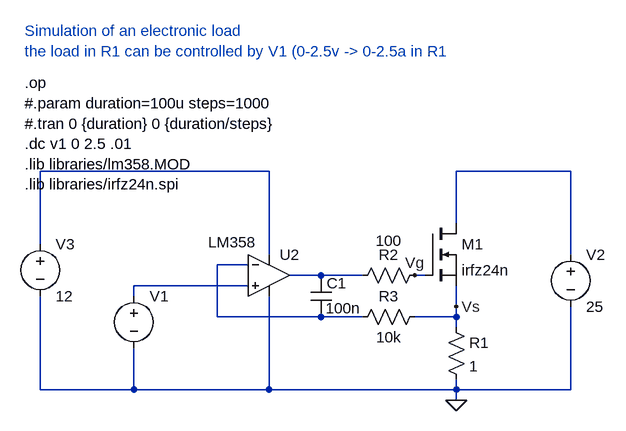
[diagram p0: schematic dummyload.asc]
dummyload.asc, the LTspice schematic file:
Version 4
SHEET 1 968 680
WIRE 336 144 -16 144
WIRE 800 144 624 144
WIRE 624 224 624 144
WIRE -16 256 -16 144
WIRE 336 272 336 144
WIRE 800 272 800 144
WIRE 304 288 256 288
WIRE 416 304 368 304
WIRE 480 304 416 304
WIRE 576 304 560 304
WIRE 304 320 128 320
WIRE 128 336 128 320
WIRE 624 352 624 320
WIRE 256 368 256 288
WIRE 416 368 256 368
WIRE 480 368 416 368
WIRE 624 368 624 352
WIRE 624 368 560 368
WIRE 624 384 624 368
WIRE -16 480 -16 336
WIRE 128 480 128 416
WIRE 128 480 -16 480
WIRE 336 480 336 336
WIRE 336 480 128 480
WIRE 624 480 624 464
WIRE 624 480 336 480
WIRE 800 480 800 352
WIRE 800 480 624 480
WIRE 624 496 624 480
FLAG 624 496 0
FLAG 560 304 Vg
FLAG 624 352 Vs
SYMBOL Voltage 800 256 R0
SYMATTR InstName V2
SYMATTR Value 25
SYMBOL Res 608 368 R0
SYMATTR InstName R1
SYMATTR Value 1
SYMBOL Res 576 288 R90
WINDOW 0 0 56 VBottom 2
WINDOW 3 -53 56 VTop 2
SYMATTR InstName R2
SYMATTR Value 100
SYMBOL nmos 576 224 R0
SYMATTR InstName M1
SYMATTR Value irfz24n
SYMATTR Prefix X
SYMBOL Voltage 128 320 R0
SYMATTR InstName V1
SYMATTR Value ""
SYMBOL OpAmps/opamp2 336 240 R0
WINDOW 3 -94 13 Left 2
SYMATTR Value LM358
SYMATTR InstName U2
SYMBOL Voltage -16 240 R0
SYMATTR InstName V3
SYMATTR Value 12
SYMBOL Res 576 352 R90
WINDOW 0 0 56 VBottom 2
WINDOW 3 32 56 VTop 2
SYMATTR InstName R3
SYMATTR Value 10k
SYMBOL Cap 400 304 R0
WINDOW 0 25 12 Left 2
WINDOW 3 23 51 Left 2
SYMATTR InstName C1
SYMATTR Value 100n
TEXT -40 8 Left 2 !.op\n#.param duration=100u steps=1000\n#.tran 0 {duration} 0 {duration/steps}\n.dc v1 0 2.5 .01\n.lib libraries/lm358.MOD\n.lib libraries/irfz24n.spi
TEXT -40 -72 Left 2 ;Simulation of an electronic load\nthe load in R1 can be controlled by V1 (0-2.5v -> 0-2.5a in R1

The netlist it stands for:
* dummyload.asc
V2 N002 0 25
R1 Vs 0 1
R2 Vg N004 100
XM1 N002 Vg Vs irfz24n  ; pins D G S
V1 N005 0
XU2 N005 N003 N001 0 N004 LM358  ; pins In+ In- V+ V- OUT
V3 N001 0 12
R3 Vs N003 10k
C1 N004 N003 100n
.op
#.param duration=100u steps=1000
#.tran 0 {duration} 0 {duration/steps}
.dc v1 0 2.5 .01
.lib libraries/lm358.MOD
.lib libraries/irfz24n.spi
* Simulation of an electronic load
* the load in R1 can be controlled by V1 (0-2.5v -> 0-2.5a in R1
.backanno
.end